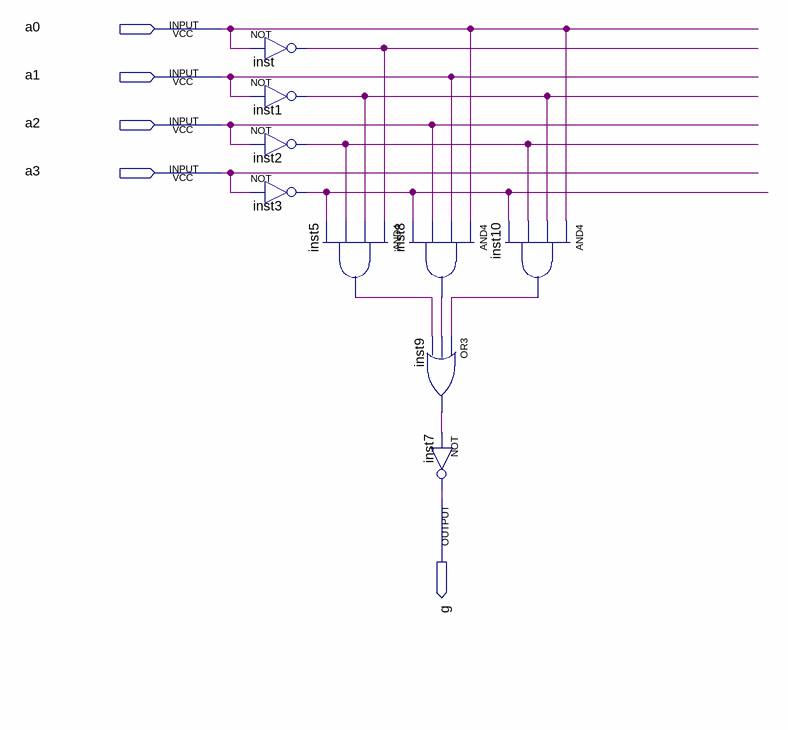
[diagram p0: schematic sheet]
// Quartus schematic G.bdf as structural Verilog: 9 symbols, 5 pins
module G (
  input  a0,
  input  a1,
  input  a2,
  input  a3,
  output g
);

  wire inst1_out, inst2_out, inst3_out, inst5_out, inst8_out, inst9_out, inst10_out, inst_out;

  not inst (inst_out, a0);
  not inst1 (inst1_out, a1);
  not inst2 (inst2_out, a2);
  not inst3 (inst3_out, a3);
  and inst5 (inst5_out, inst_out, inst1_out, inst2_out, inst3_out);
  and inst8 (inst8_out, a0, a1, a2, inst3_out);
  or inst9 (inst9_out, inst10_out, inst8_out, inst5_out);
  not inst7 (g, inst9_out);
  and inst10 (inst10_out, a0, inst1_out, inst2_out, inst3_out);
endmodule
